# Altium project BTL_test_1.PrjPcb
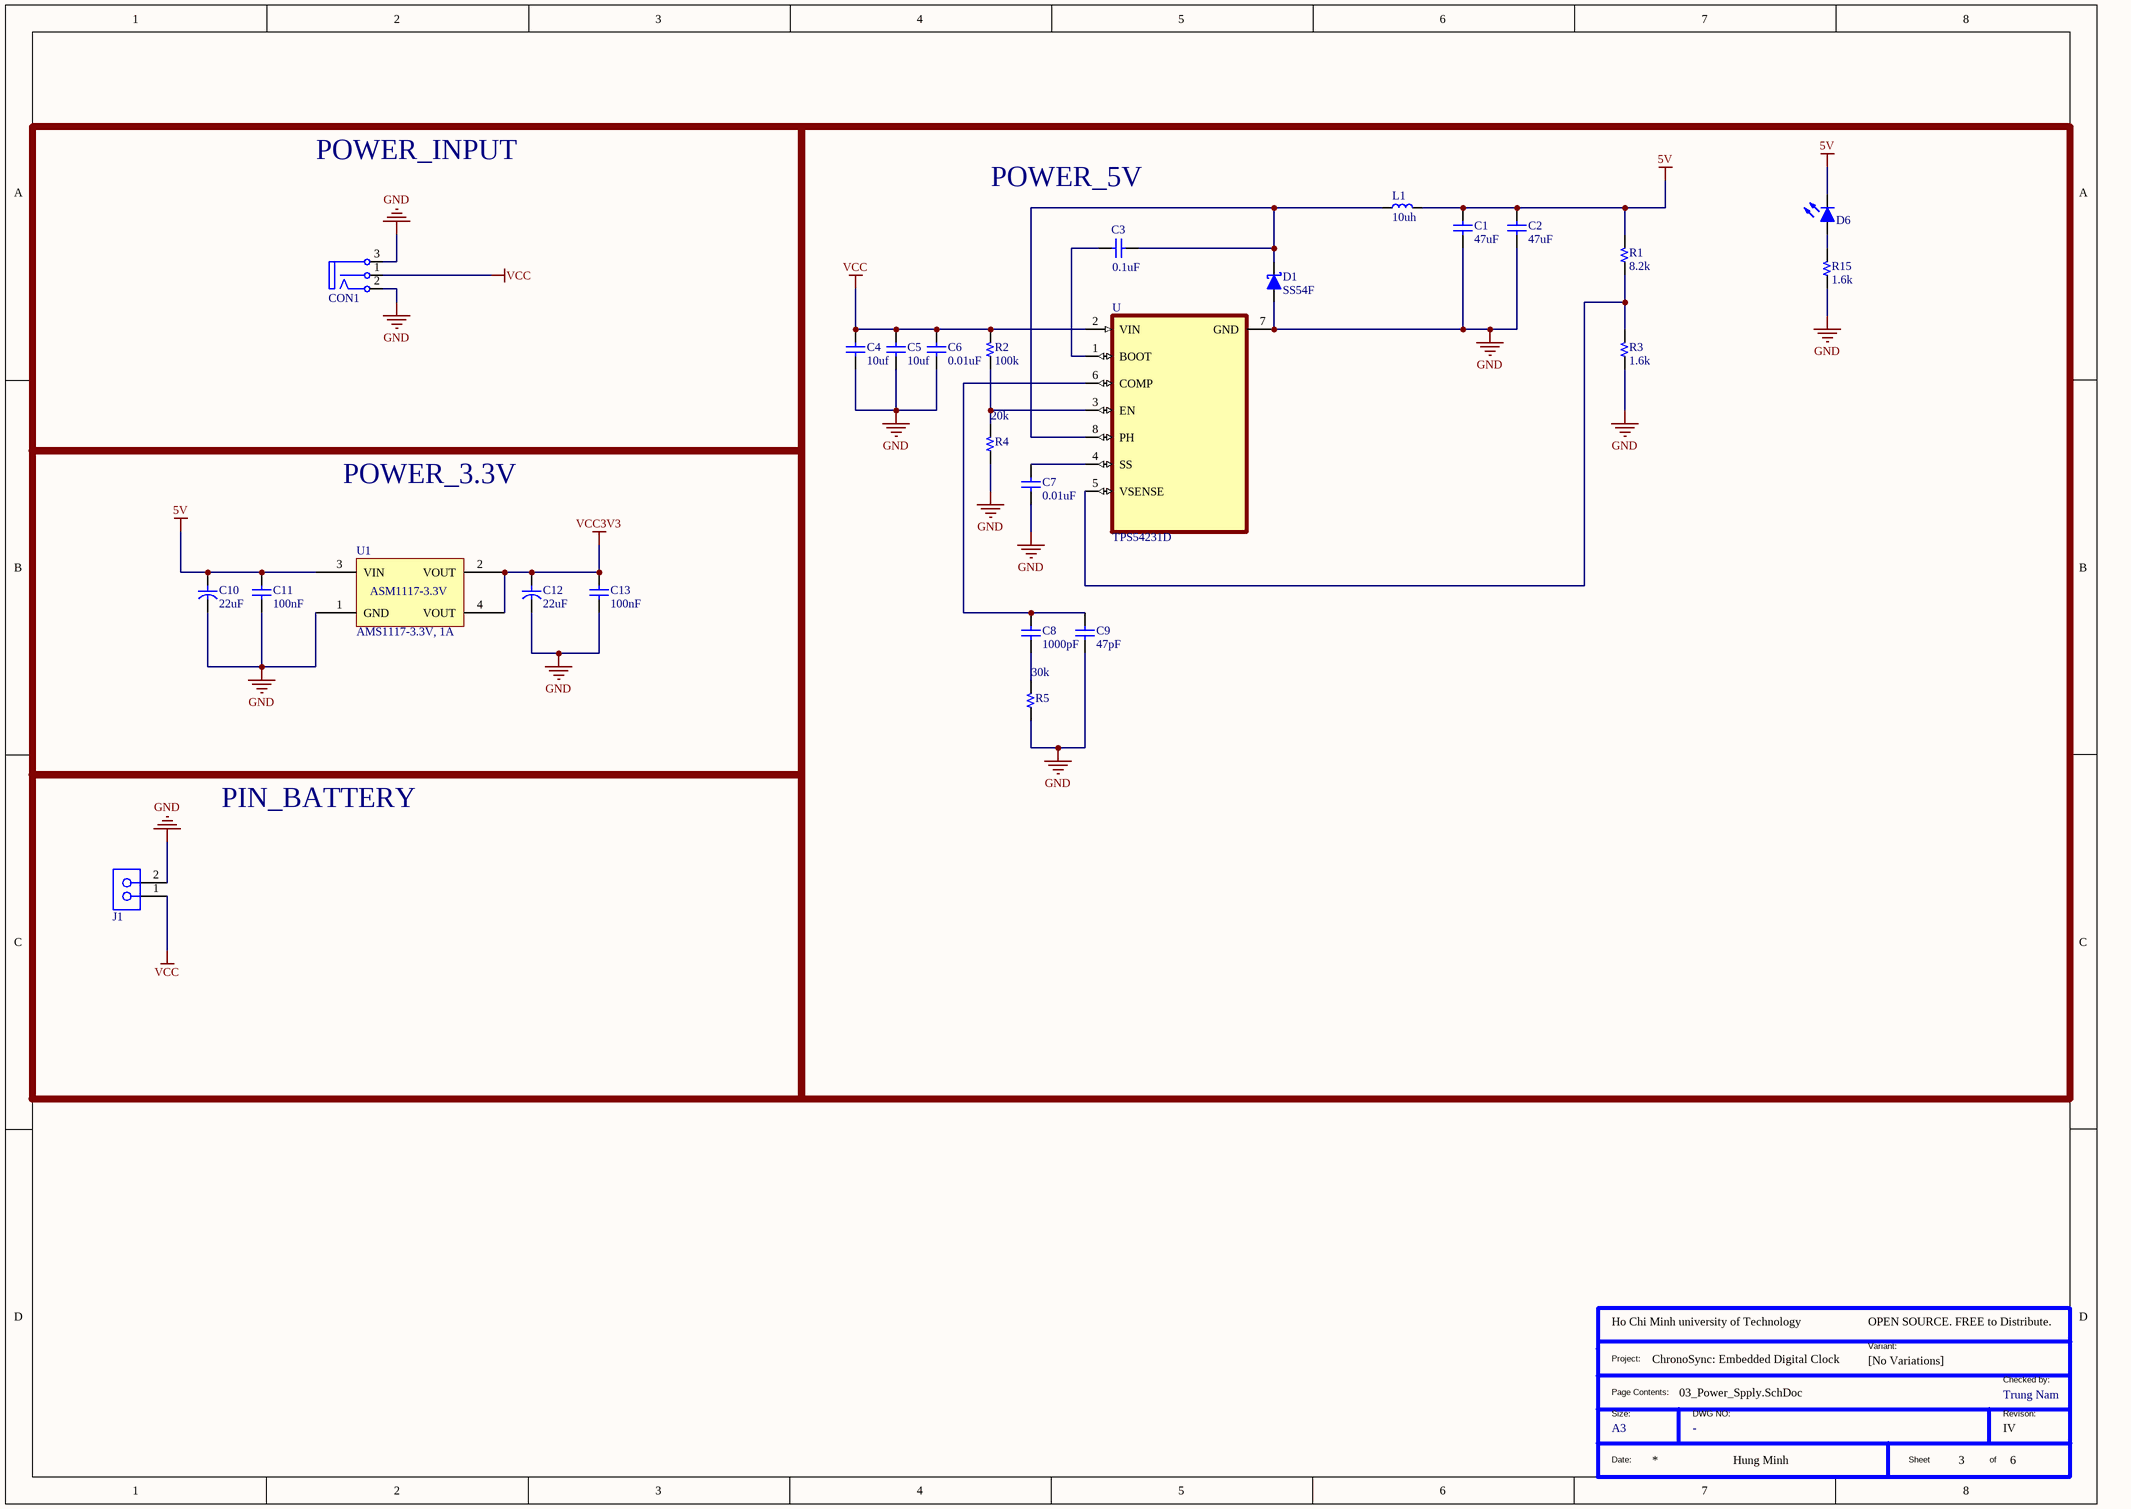
[diagram p0: 03_Power_Spply.SchDoc]
VersionRevision: IV; Project: ChronoSync: Embedded Digital Clock; DesignedByURL: Hung Minh; Company: Ho Chi Minh university of Technology
2 sheets, 52 parts. Net scope: global (net labels, ports and power ports of the same name join across sheets).
Board file: final_version.PcbDoc
Sheets:
  03_Power_Spply.SchDoc
  04_MCU.SchDoc

## Sheet 03_Power_Spply.SchDoc
size A3; SheetNumber: 3; SheetTotal: 6

### Parts
(Parts that share a designator on the sheet are numbered #1, #2 ... from top to bottom, then left to right.)
*?#1  Size: A3  Checked by: Trung Nam  (hidden comment: TitleBlock)  (graphical)
C1  47uF  [C 0805]
C2  47uF  [C 0805]
C3  0.1uF  [C 0805]
C4  10uf  [C 0805]
C5  10uf  [C 0805]
C6  0.01uF  [C 0805]
C7  0.01uF  [C 0805]
C8  1000pF  [C 0805]
C9  47pF  [C 0805]
C10  22uF  [C SMD TAN 2312 (C)]
C11  100nF  [C 0805]
C12  22uF  [C SMD TAN 2312 (C)]
C13  100nF  [C 0805]
CON1  CON DC PWR  [CONN/DC/PWR/5.0MM]  (value not drawn)
D1  SS54F  [DO-214AC (SMA)]
D6  Led  [Led 0805]  (value not drawn)
J1  6A, 150V  [691402910002B]  (value not drawn)
L1  10uh  [Inductor SMD CDRH3D67]
R1  8.2k  [R 0805]
R2  100k  [R 0805]
R3  1.6k  [R 0805]
R4  20k  [R 0805]
R5  30k  [R 0805]
R15  1.6k  [R 0805]
U  TPS54231D  [SOIC127P599X175-8N]
U1  AMS1117-3.3V, 1A  [AMS1117-3.3V SOT223]

### Blocks framed on the sheet
POWER_INPUT: CON1
POWER_5V: C1-C9 D1 D6 L1 R1-R5 R15 U
POWER_3.3V: C10-C13 U1
PIN_BATTERY: J1

### Nets
5V: C1.2 C2.2 C10.1 C11.2 D6.2(K) L1.2 R1.2 U1.3(VIN)
GND: C1.1 C2.1 C4.1 C5.1 C6.1 C7.1 C9.1 C10.2 C11.1 C12.2 C13.1 CON1.2(T) CON1.3(TN) D1.1(A) J1.2 R3.1 R4.1 R5.1 R15.1 U.7(GND) U1.1(GND)
VCC: C4.2 C5.2 C6.2 CON1.1(S) J1.1 R2.2 U.2(VIN)
VCC3V3: C12.1 C13.2 U1.2(VOUT) U1.4(VOUT)
NetC3_1: C3.1 D1.2(K) L1.1 U.8(PH)
NetC3_2: C3.2 U.1(BOOT)
NetC7_2: C7.2 U.4(SS)
NetC8_1: C8.1 R5.2
NetC8_2: C8.2 C9.2 U.6(COMP)
NetD6_1: D6.1(A) R15.2
NetR1_1: R1.1 R3.2 U.5(VSENSE)
NetR2_1: R2.1 R4.2 U.3(EN)

### Notes on the sheet
- (in symbol AMS1117-3.3V) ASM1117-3.3V
- (in symbol TitleBlock) OPEN SOURCE. FREE to Distribute.; Project:; Variant:; [No Variations]; Checked by:; Page Contents:; Size:; DWG NO:; Revison:; Date:; Sheet; of

### Library data of the parts
*?#1 = TitleBlock: Standard Title Block; DWG NO: -
C1-C9 C11 C13 = Capacitor NP: Capacitor non-pol
C10 C12 = Capacitor: Capacitor pol
CON1 = CON DC PWR: DC input connector
D1 = Diode Schottky: Schottky Diode
D6 = Led: Typical LED
J1 = 691402910002B: WR-TBL Series 4029 Horizontal Entry, THT, pitch 2.54mm, 2p; Manufacturer: Wurth Elektronik; Modularity: No; ComponentLink1Description: Datasheet; ComponentLink1URL: https://www.we-online.com/redexpert/spec/691402910002B?ad; Manufacturer Part Number: 691402910002B; Category: Terminal Blocks; Match Code: WR-TBL; Mount: Through Hole; Operating Temperature Max: 105°C; Operating Temperature Min: -40°C; Packaging: Box; Application: Screwless; Number of Pins: 2; Number of Rows: 1; Orientation: Horizontal; Pitch: 2.54mm; Rated Current: 6A; Working Voltage: 150V; Supplier 1 URL: N/A; Supplier 2 URL: N/A; Supplier 3 URL: https://www.thegioiic.com/kf141-2-54-2-r-terminal-block-2-tiep-diem-cam-day-ngang-2-54mm-150v-2a; Value: 6A, 150V; LCSC Part #: N/A; Supplier 1: Mouser; Supplier 1 Part Number: N/A; Supplier 2: Digi-Key; Supplier 2 Part Number: N/A; Supplier 3: thegioiic; Supplier 3 Part Number: N/A
L1 = Inductor
R1-R5 R15 = Resistor
U = TPS54231D: å…·æœ‰Eco-modeï¼†tradeçš„3.5è‡³28Vè¾“å…¥ï¼Œ2Aï¼Œ570kHzé™åŽ‹è½¬æ¢å™¨ï¼›8-SOIC -40è‡³150; MF: Texas Instruments; DigiKey-Purchase-URL: https://snapeda.com/shop?store=DigiKey&id=456068; Value: *; MP: TPS54231D; Availability: Unavailable; Price: None; Texas_Instruments-Purchase-URL: https://snapeda.com/shop?store=Texas+Instruments&id=456068; Package: SOIC-8 Texas Instruments; SnapEDA_Link: https://www.snapeda.com/parts/TPS54231D/Texas%20Instruments/view-part/456068/?ref=snap
U1 = AMS1117-3.3V: 1A 60dB@(120Hz) Fixed 3.3V Positive electrode 12V SOT-223 Linear Voltage Regulators (LDO) ROHS; Manufacturer: AMS; Pad Count: 4; Voltage Input Maximum: 15V; Manufacturer Part Number: N/A; Current Input Maximum: N/A; Current Output Maximum: 1A; Voltage Output: 3.3V; Supplier 1 URL: N/A; Supplier 2 URL: N/A; Supplier 3 URL: https://www.thegioiic.com/ams1117-3-3v-ic-on-ap-3-3v-1a-sot-223; Value: AMS1117-3.3V, 1A; Mount: SMD/SMT; Operating Temperature Max: + 85 C; Operating Temperature Min: - 40 C; Packaging: Tape and Reel; Supplier 1: Mouser; Supplier 1 Part Number: N/A; Supplier 2: Digi-Key; Supplier 2 Part Number: N/A; Supplier 3: thegioiic; Supplier 3 Part Number: N/A; ComponentLink1Description: Datasheet; ComponentLink1URL: http://www.advanced-monolithic.com/pdf/ds1117.pdf; LCSC Part #: C347222

## Sheet 04_MCU.SchDoc
size A3; SheetNumber: 4; SheetTotal: 6
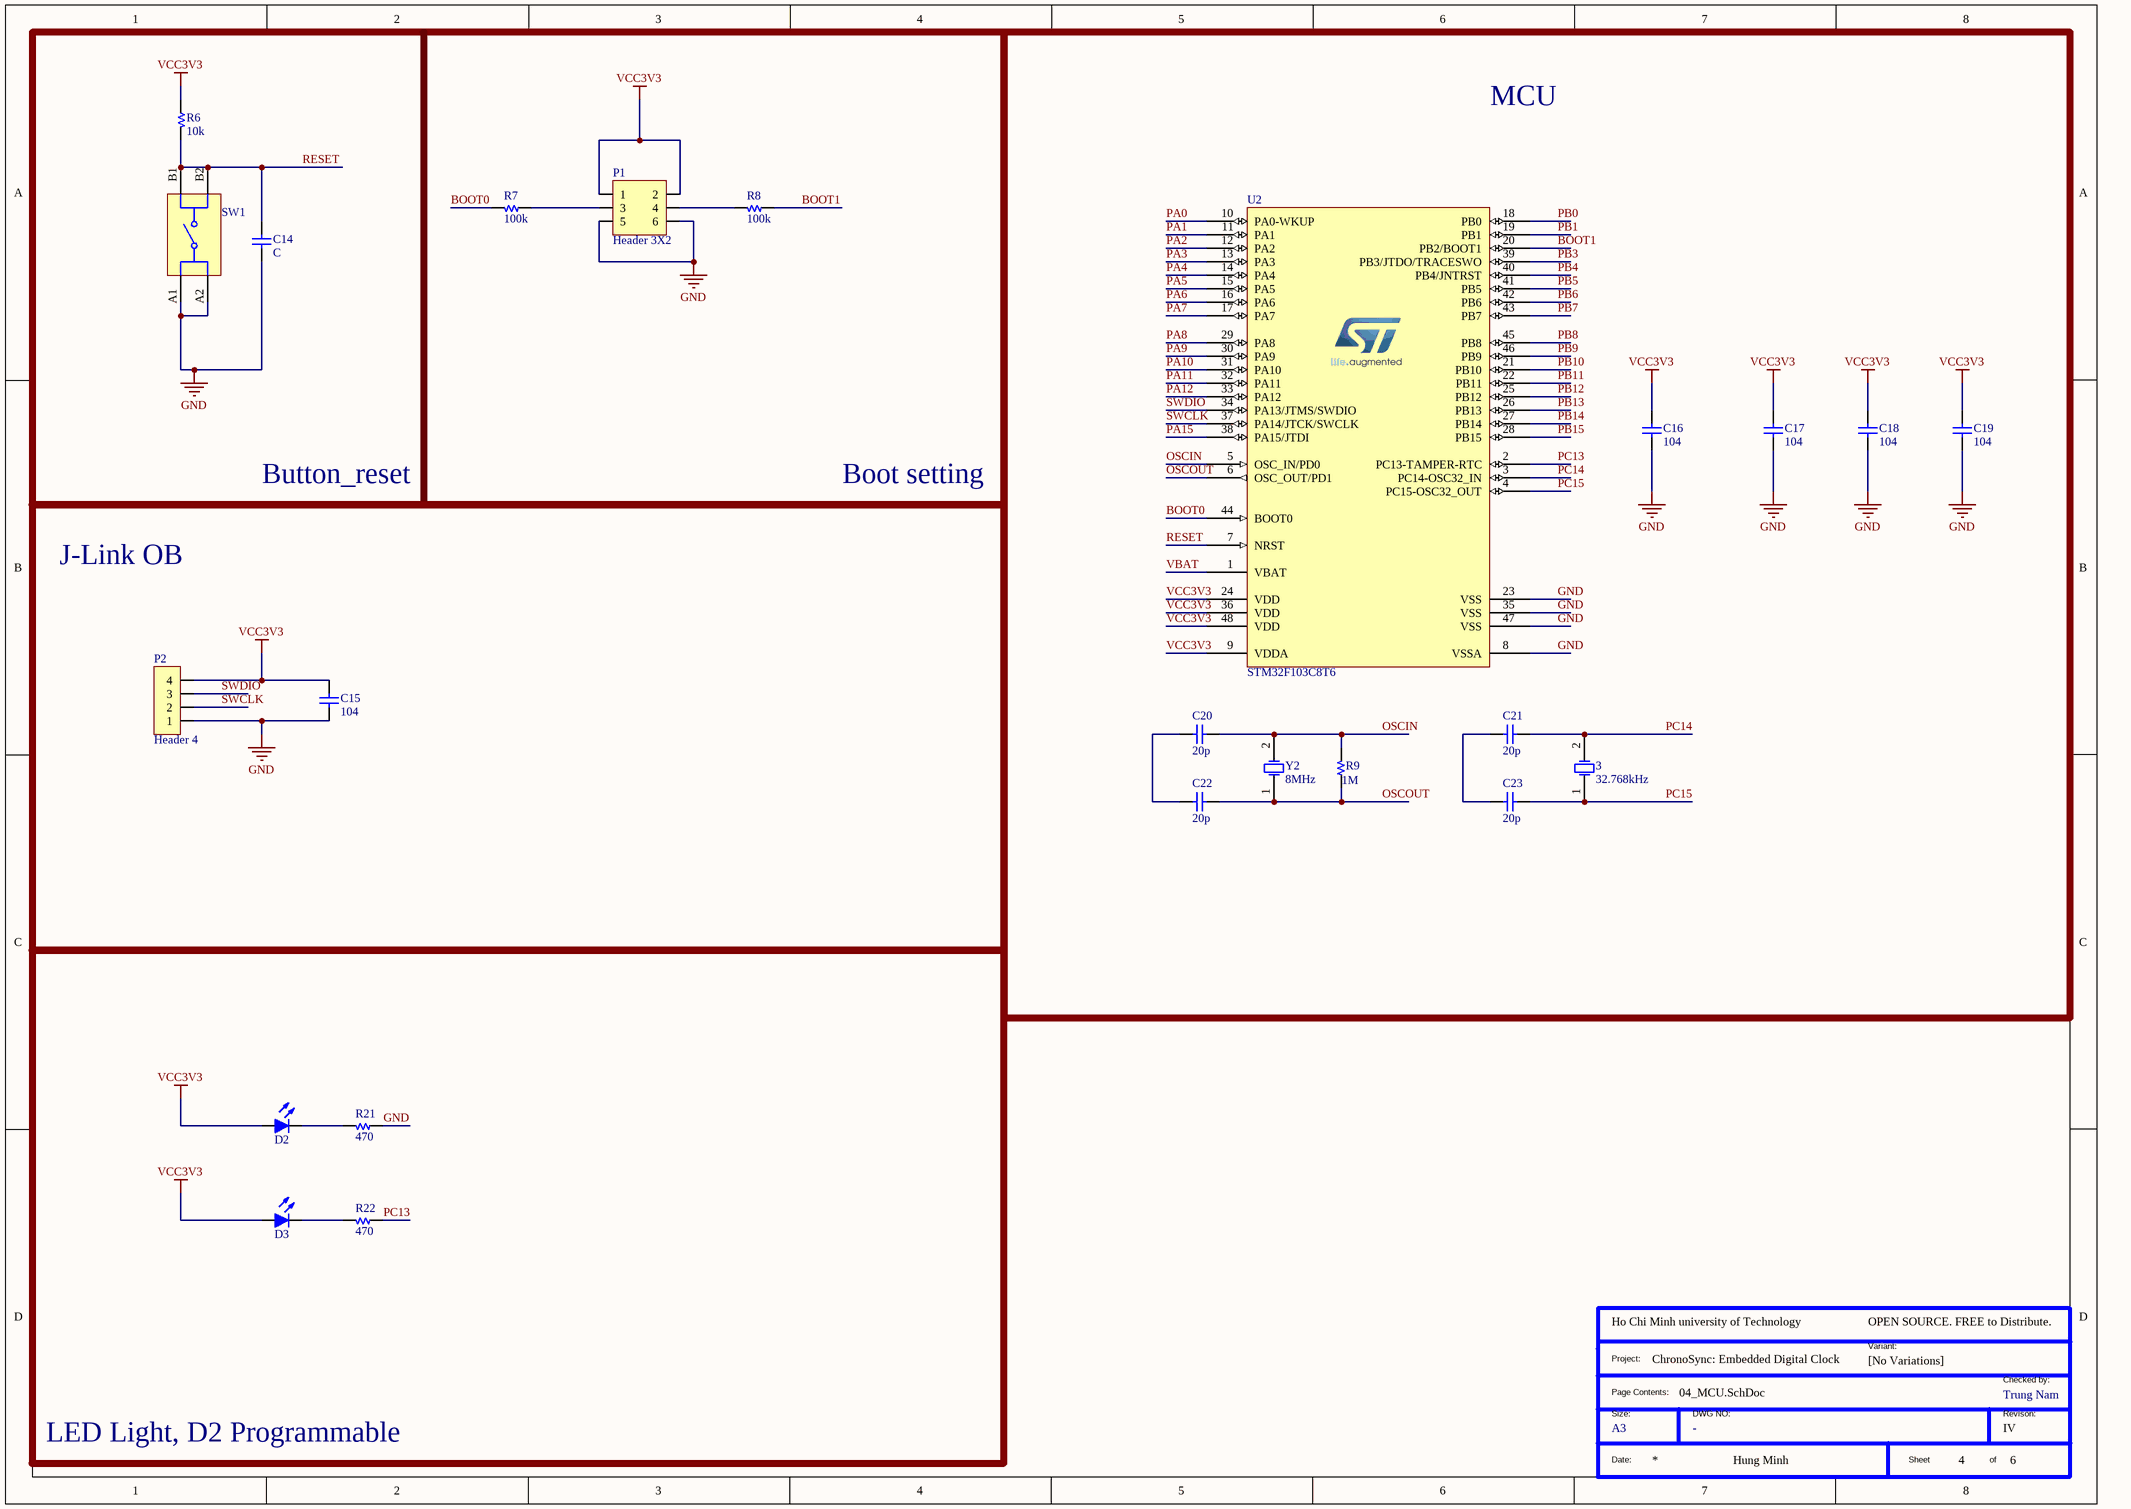
[diagram p1: 04_MCU.SchDoc]

### Parts
(Parts that share a designator on the sheet are numbered #1, #2 ... from top to bottom, then left to right.)
3  32.768kHz  [XKXGI-SUA-32.768K]
*?#2  Size: A3  Checked by: Trung Nam  (hidden comment: TitleBlock)  (graphical)
C14  C  [C 0805]
C15  104  [C 0805]
C16  104  [C 0805]
C17  104  [C 0805]
C18  104  [C 0805]
C19  104  [C 0805]
C20  20p  [C 0805]
C21  20p  [C 0805]
C22  20p  [C 0805]
C23  20p  [C 0805]
D2  Led  [Led 0805]  (value not drawn)
D3  Led  [Led 0805]  (value not drawn)
P1  Header 3X2  [HDR/Header/6/DL]
P2  Header 4  [HDR/Header/4]
R6  10k  [R 0805]
R7  100k  [R 0805]
R8  100k  [R 0805]
R9  1M  [R 0805]
R21  470  [R 0805]
R22  470  [R 0805]
SW1  430152043826  [WS-TASV_L6W6H4.3_4301x20438x6]  (value not drawn)
U2  STM32F103C8T6  [STM32F103C8T6]
Y2  8MHz  [WE-XTAL_HC49/4HSMX]

### Blocks framed on the sheet
MCU: 3 C16-C23 R9 U2 Y2
LED Light, D2 Programmable: D2 D3 R21 R22

### Nets
GND: C14.2 C15.2 C16.1 C17.1 C18.1 C19.1 P1.5 P1.6 P2.1 R21.1 SW1.A1 SW1.A2 U2.8(VSSA) U2.23(VSS) U2.35(VSS) U2.47(VSS)
VCC3V3: C15.1 C16.2 C17.2 C18.2 C19.2 D2.1(A) D3.1(A) P1.1 P1.2 P2.4 R6.1 U2.9(VDDA) U2.24(VDD) U2.36(VDD) U2.48(VDD)
BOOT0: R7.2 U2.44(BOOT0)
BOOT1: R8.1 U2.20(PB2/BOOT1)
OSCIN: C20.1 R9.2 U2.5(OSC_IN/PD0) Y2.2(OSC2)
OSCOUT: C22.1 R9.1 U2.6(OSC_OUT/PD1) Y2.1(OSC1)
PA0: U2.10(PA0-WKUP)
PA1: U2.11(PA1)
PA2: U2.12(PA2)
PA3: U2.13(PA3)
PA4: U2.14(PA4)
PA5: U2.15(PA5)
PA6: U2.16(PA6)
PA7: U2.17(PA7)
PA8: U2.29(PA8)
PA9: U2.30(PA9)
PA10: U2.31(PA10)
PA11: U2.32(PA11)
PA12: U2.33(PA12)
PA15: U2.38(PA15/JTDI)
PB0: U2.18(PB0)
PB1: U2.19(PB1)
PB3: U2.39(PB3/JTDO/TRACESWO)
PB4: U2.40(PB4/JNTRST)
PB5: U2.41(PB5)
PB6: U2.42(PB6)
PB7: U2.43(PB7)
PB8: U2.45(PB8)
PB9: U2.46(PB9)
PB10: U2.21(PB10)
PB11: U2.22(PB11)
PB12: U2.25(PB12)
PB13: U2.26(PB13)
PB14: U2.27(PB14)
PB15: U2.28(PB15)
PC13: R22.1 U2.2(PC13-TAMPER-RTC)
PC14: 3.2(OSC2) C21.1 U2.3(PC14-OSC32_IN)
PC15: 3.1(OSC1) C23.1 U2.4(PC15-OSC32_OUT)
RESET: C14.1 R6.2 SW1.B1 SW1.B2 U2.7(NRST)
SWCLK: P2.2 U2.37(PA14/JTCK/SWCLK)
SWDIO: P2.3 U2.34(PA13/JTMS/SWDIO)
VBAT: U2.1(VBAT)
NetC20_2: C20.2 C22.2
NetC21_2: C21.2 C23.2
NetD2_2: D2.2(K) R21.2
NetD3_2: D3.2(K) R22.2
NetP1_3: P1.3 R7.1
NetP1_4: P1.4 R8.2

### Notes on the sheet
- Button_reset
- Boot setting
- J-Link OB
- (in symbol TitleBlock) OPEN SOURCE. FREE to Distribute.; Project:; Variant:; [No Variations]; Checked by:; Page Contents:; Size:; DWG NO:; Revison:; Date:; Sheet; of

### Library data of the parts
3 = XKXGI-SUA-32.768K: 32.768kHz Surface Mount Crystal 12.5pF ±20ppm ±30ppm SMD3215-2P Crystals ROHS; Manufacturer: YXC Crystal Oscillators; Frequency Stability: +/-30ppm; Frequency Tolerance: +/-20ppm; ComponentLink1Description: Datasheet; ComponentLink1URL: https://www.lcsc.com/datasheet/lcsc_datasheet_2210261730_YXC-Crystal-Oscillators-XKXGI-SUA-32-768K_C5213671.pdf; Frequency: 32.768kHz; LCSC Part #: C5213671; Load Capacitance: 12.5pF; Manufacturer Part Number: XKXGI-SUA-32.768K; Mount: SMD/SMT; Operating Temperature Max: + 85 C; Operating Temperature Min: - 40 C; Package / Case: SMD3215-2P; Packaging: Tape and Reel; Supplier 1: Mouser; Supplier 1 Part Number: N/A; Supplier 1 URL: N/A; Supplier 2: Digi-Key; Supplier 2 Part Number: N/A; Supplier 2 URL: N/A; Supplier 3: thegioiic; Supplier 3 Part Number: N/A; Supplier 3 URL: N/A; Value: 32.768kHz
*?#2 = TitleBlock: Standard Title Block; DWG NO: -
C14-C23 = Capacitor NP: Capacitor non-pol
D2 D3 = Led: Typical LED
P1 = Header 3X2: Header, 3-Pin, Dual row
P2 = Header 4: Header, 4-Pin
R6-R9 R21 R22 = Resistor
SW1 = 430152043826: WS-TASV SMT Tact Switch, L6 x W6 x H4.3mm, 260g, SPST-NO, 12V, 50mA; Manufacturer: Wurth Elektronik; Washable: No; Rated Voltage: 12VDC; Manufacturer Part Number: 430152043826; Category: Tact Switches; Match Code: WS-TASV; Mount: Surface Mount; Operating Temperature Max: 85°C; Operating Temperature Min: -40°C; Packaging: Tape and Reel; Length: 6mm; Width: 6mm; Height: 4.3mm; Circuit: SPST-NO; Contact Material: Stainless Steel; Operation Force: 260g; Rated Current: 50mA; Terminal Material: Copper Alloy; Terminal Plating: Silver; Supplier 1 URL: https://www.mouser.vn/ProductDetail/Wurth-Elektronik/430152043826?qs=wr8lucFkNMUjBcFj1giTsA%3D%3D; Supplier 2 URL: https://www.digikey.com/en/products/detail/w%C3%BCrth-elektronik/430152043826/5208994; Supplier 3 URL: https://www.thegioiic.com/nut-nhan-6x6mm-cao-4-3mm-4-chan-smd; LCSC Part #: N/A; ComponentLink1Description: Datasheet; ComponentLink1URL: https://www.we-online.com/redexpert/spec/430152043826?ad; Package / Case: 0805; Supplier 1: Mouser; Supplier 1 Part Number: 710-430152043826; Supplier 2: Digi-Key; Supplier 2 Part Number: 732-6991-2-ND; Supplier 3: thegioiic; Supplier 3 Part Number: OEM; Value: 430152043826
U2 = STM32F103C8T6: ARM Microcontrollers - MCU 32BIT Cortex M3 64KB 20KB RAM 2X12 ADC; Manufacturer: STMicroelectronics; Manufacturer Part Number: STM32F103C8T6TR; Pad count: 48; Supply Voltage - Max: 3.6 V; Supply Voltage - Min: 2 V; Part Number: STM32F103C8T6; Value: STM32F103C8T6; Supplier 1 URL: https://www.mouser.com/ProductDetail/STMicroelectronics/STM32F103C8T6?qs=bhCVus9SdFtq6kqxsU5%2FDA%3D%3D; Supplier 2 URL: https://www.digikey.com/en/products/detail/stmicroelectronics/stm32f103c8t6tr/2122442; Supplier 3 URL: https://www.thegioiic.com/stm32f103c8t6-32-bit-arm-cortex-m3-microcontroller-72mhz-64kb-flash-48-lqfp; Packaging: Tape and Reel; Supplier 1: Mouser; Supplier 1 Part Number: 511-STM32F103C8T6; Supplier 2: Digi-Key; Supplier 2 Part Number: 497-17666-2-ND; Supplier 3: thegioiic; Supplier 3 Part Number: STM32F103C8T6; Mount: SMD/SMT; Operating Temperature Max: + 85 C; Operating Temperature Min: - 40 C; Package / Case: LQFP48; ComponentLink1Description: Datasheet; ComponentLink1URL: https://www.mouser.com/datasheet/2/389/stm32f103c8-1851025.pdf; LCSC Part #: C8734
Y2 = 071105086016: WE-XTAL Quartz Crystal, SMT, HC49/4HSMX, 8MHz, +/-30ppm; Manufacturer Part Number: 830003151; Manufacturer: Wurth Elektronik; Frequency Stability: +/-50ppm; Load Capacitance: 16pF; Frequency: 8MHz; Frequency Tolerance: +/-30ppm; Supplier 3 URL: https://www.thegioiic.com/thach-anh-8mhz-2-chan-smd-hc49-s; ComponentLink1Description: Datasheet; ComponentLink1URL: https://katalog.we-online.com/pbs/datasheet/830003151.pdf; Supplier 1 URL: https://www.mouser.com/ProductDetail/Wurth-Elektronik/830003151?qs=2WXlatMagcHisY7XHApyYg%3D%3D; Supplier 2 URL: https://www.digikey.com/en/products/detail/w%C3%BCrth-elektronik/830003151/13979296; Value: 8MHz; Mount: SMD/SMT; Operating Temperature Max: + 60 C; Operating Temperature Min: - 10 C; Package / Case: HC49/4HSMX; Packaging: Tape and Reel; Supplier 1: Mouser; Supplier 1 Part Number: 710-830003151; Supplier 2: Digi-Key; Supplier 2 Part Number: 732-830003151TR-ND; Supplier 3: thegioiic; Supplier 3 Part Number: N/A

## Nets that join several sheets
GND: 03_Power_Spply (21 pins), 04_MCU (16 pins)
VCC3V3: 03_Power_Spply (C12.1 C13.2 U1.2 U1.4), 04_MCU (15 pins)